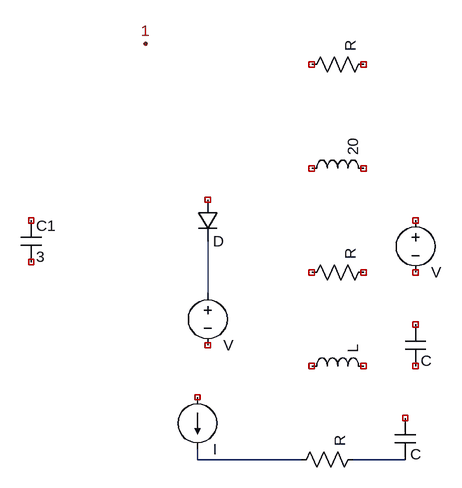
[diagram p0: schematic g.asc]
g.asc, the LTspice schematic file:
Version 4
SHEET 1 524 900
WIRE 160 624 160 544
WIRE 144 880 144 864
WIRE 304 880 144 880
WIRE 464 880 384 880
FLAG 64 240 1
SYMBOL diode 144 480 R0
SYMBOL res 304 288 R270
SYMBOL res 288 896 R270
SYMBOL res 304 608 R270
SYMBOL cap 448 816 R0
SYMBOL cap 464 672 R0
SYMBOL ind 304 752 R270
SYMBOL ind 304 448 R270
SYMATTR Value 20
SYMBOL voltage 160 608 R0
SYMBOL voltage 480 496 R0
SYMBOL current 144 784 R0
SYMBOL cap -128 512 R0
SYMATTR InstName C1
SYMATTR Value 3

The netlist it stands for:
* g.asc
D§? NC_01 N001 D
R§? NC_02 NC_03 R
R§? N002 N003 R
R§? NC_04 NC_05 R
C§? NC_06 N003 C
C§? NC_07 NC_08 C
L§? NC_09 NC_10 L
L§? NC_11 NC_12 20
V§? N001 NC_13 V
V§? NC_14 NC_15 V
I§? NC_16 N002 I
C1 NC_17 NC_18 3
.model D D
.lib standard.dio
.backanno
.end